# Altium schematic sheet MB1066.SchDoc
size A4; Revision: A.2
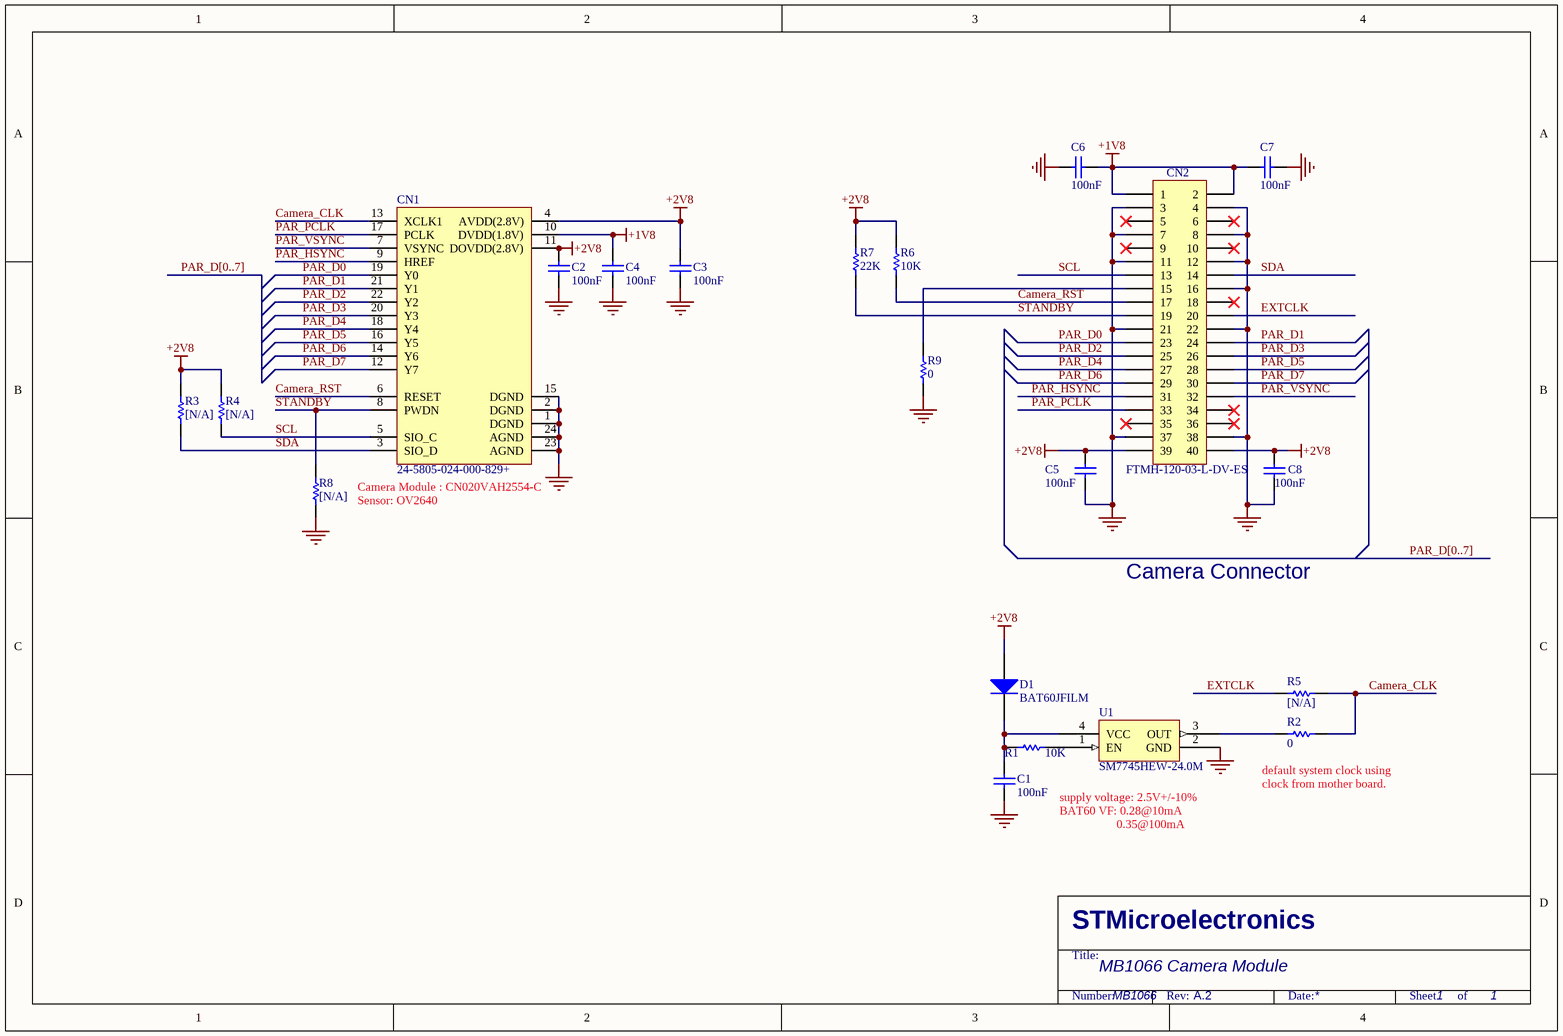
[diagram p0: MB1066.SchDoc]

## Parts
C1  100nF  [0603C]
C2  100nF  [0603C]
C3  100nF  [0603L]
C4  100nF  [0603C]
C5  100nF  [0603C]
C6  100nF  [0603C]
C7  100nF  [0603C]
C8  100nF  [0603C]
CN1  24-5805-024-000-829+  [24-5805-024-000-829]
CN2  FTMH-120-03-L-DV-ES  [FTMH-120-03-L-DV-ES]
D1  BAT60JFILM  [SOD-323]
R1  10K  [0603R]
R2  0  [0603R]
R3  [N/A]  [0603R]
R4  [N/A]  [0603R]
R5  [N/A]  [0603R]
R6  10K  [0603R]
R7  22K  [0603R]
R8  [N/A]  [0603R]
R9  0  [0603R]
U1  SM7745HEW-24.0M  [XTAL_5X7]

## Nets
+1V8: C4.1 C6.2 C7.1 CN1.10(DVDD(1.8V)) CN2.1 CN2.2
+2V8: C2.1 C3.1 C5.1 C8.1 CN1.4(AVDD(2.8V)) CN1.11(DOVDD(2.8V)) CN2.39 CN2.40 D1.1(A) R3.1 R4.1 R6.1 R7.1
GND: C1.2 C2.2 C3.2 C4.2 C5.2 C6.1 C7.2 C8.2 CN1.1(DGND) CN1.2(DGND) CN1.15(DGND) CN1.23(AGND) CN1.24(AGND) CN2.3 CN2.4 CN2.7 CN2.8 CN2.11 CN2.12 CN2.16 CN2.21 CN2.22 CN2.37 CN2.38 R8.1 R9.2 U1.2(GND)
Camera_CLK: CN1.13(XCLK1) R2.2 R5.2
Camera_RST: CN1.6(RESET) CN2.17 R6.2
EXTCLK: CN2.20 R5.1
PAR_D0: CN1.19(Y0) CN2.23
PAR_D1: CN1.21(Y1) CN2.24
PAR_D2: CN1.22(Y2) CN2.25
PAR_D3: CN1.20(Y3) CN2.26
PAR_D4: CN1.18(Y4) CN2.27
PAR_D5: CN1.16(Y5) CN2.28
PAR_D6: CN1.14(Y6) CN2.29
PAR_D7: CN1.12(Y7) CN2.30
PAR_HSYNC: CN1.9(HREF) CN2.31
PAR_PCLK: CN1.17(PCLK) CN2.33
PAR_VSYNC: CN1.7(VSYNC) CN2.32
SCL: CN1.5(SIO_C) CN2.13 R4.2
SDA: CN1.3(SIO_D) CN2.14 R3.2
STANDBY: CN1.8(PWDN) CN2.19 R7.2 R8.2
NetC1_1: C1.1 D1.2(K) R1.1 U1.4(VCC)
NetCN2_15: CN2.15 R9.1
NetR1_2: R1.2 U1.1(EN)
NetR2_1: R2.1 U1.3(OUT)

Not connected (* = marked no-connect by the designer): CN2 5* 6* 9* 10* 18* 34* 35* 36*

## Buses and harness runs
bus PAR_D[0..7]

## Notes on the sheet
- Camera Module : CN020VAH2554-C
  Sensor: OV2640
- Camera Connector
- supply voltage: 2.5V+/-10%
  BAT60 VF: 0.28@10mA
  0.35@100mA
- (near R2) default system clock using clock from mother board.
- MB1066 Camera Module
- MB1066
- 1
- STMicroelectronics
- Title:
- Number:
- Rev:
- Date:
- Sheet       of

## Library data of the parts
C1-C8 = Cap: Capacitor; Value: 10nF; Published: 8-Jun-2000; Revision: July-2002: Re-released for DXP Platform.; Publisher: Altium Limited
CN2 = Header 20X2: 20*2Pins, 1mm_SMT, male; Revision: 17-Jul-2002: Re-released for DXP Platform.; Publisher: Altium Limited
D1 = Diode: Default Diode; Code - JEDEC: DO-214-AB; Published: 8-Jun-2000; Revision: July-2002: Re-released for DXP Platform.; Publisher: Altium Limited
R1 R4-R9 = Res1: Resistor; Value: 1K; Published: 8-Jun-2000; Revision: July-2002: Re-released for DXP Platform.; Publisher: Altium Limited
R2 = Res1: Resistor; Published: 8-Jun-2000; Revision: July-2002: Re-released for DXP Platform.; Publisher: Altium Limited; Value: 0
R3 = Res1: Resistor 10K; Value: 1K; Published: 8-Jun-2000; Revision: July-2002: Re-released for DXP Platform.; Publisher: Altium Limited
U1 = SM7745HEV-50.0M